# Altium schematic sheet MicroMultimeter_LED_Sch.SchDoc: MicroMultimeter - LED
size 127 x 101 mm; Author: Hom; CompanyName: KitSprout; DrawnBy: Hom; Engineer: Hom; Organization: KitSprout; Revision: A; SheetNumber: 1; SheetTotal: 1; License: CC BY-SA 4.0; Version: 1.0; LibVersion: 1.4; PageSetup: Record=PageOptions|CenterHorizontal=True|CenterVertical=True|PrintScale=1.00|XCorrection=1.00|YCorrection=1.00|PrintKind=0|BorderSize=5000000|LeftOffset=0|BottomOffset=0|Orientation=2|PaperLength=1000|PaperWidth=1000|Scale=100|PaperSource=7|PrintQuality=-3|MediaType=1|DitherType=10|PrintScaleMode=0|PaperKind=A4|PaperIndex=9
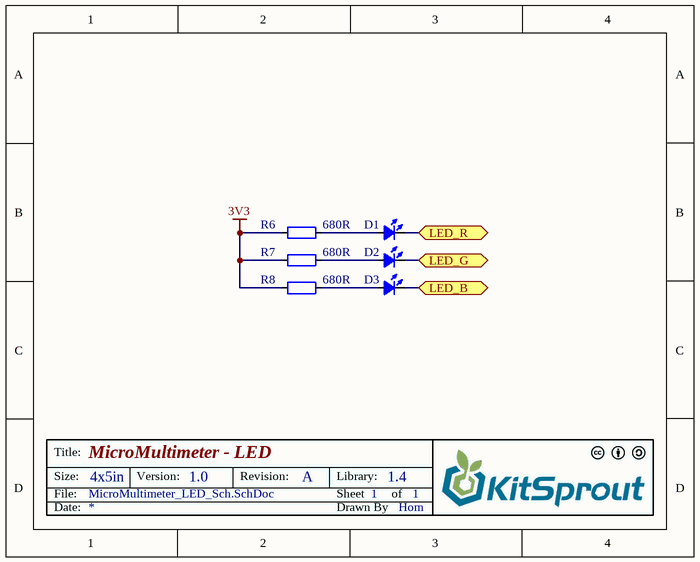
[diagram p0: MicroMultimeter_LED_Sch.SchDoc]

## Parts
D1  LED_0603  [LED_0603_RED]  (value not drawn)
D2  LED_0603  [LED_0603_GREEN]  (value not drawn)
D3  LED_0603  [LED_0603_BLUE]  (value not drawn)
R6  value 680R  [RES_0603]  (hidden comment: Res_0603)
R7  value 680R  [RES_0603]  (hidden comment: Res_0603)
R8  value 680R  [RES_0603]  (hidden comment: Res_0603)

## Ports
LED_B, LED_G, LED_R

## Nets
3V3: R6.2 R7.2 R8.1
LED_B: D3.2(K) ; port LED_B
LED_G: D2.2(K) ; port LED_G
LED_R: D1.2(K) ; port LED_R
NetD1_1: D1.1(A) R6.1
NetD2_1: D2.1(A) R7.1
NetD3_1: D3.1(A) R8.2

## Notes on the sheet
- Title:
- Size:
- Date:
- File:
- 4x5in
- Version:
- Revision:
- Sheet
- Drawn By
- Library:
- of

## Library data of the parts
D1-D3 = LED_0603: LED
R6-R8 = Res_0603: Resistor